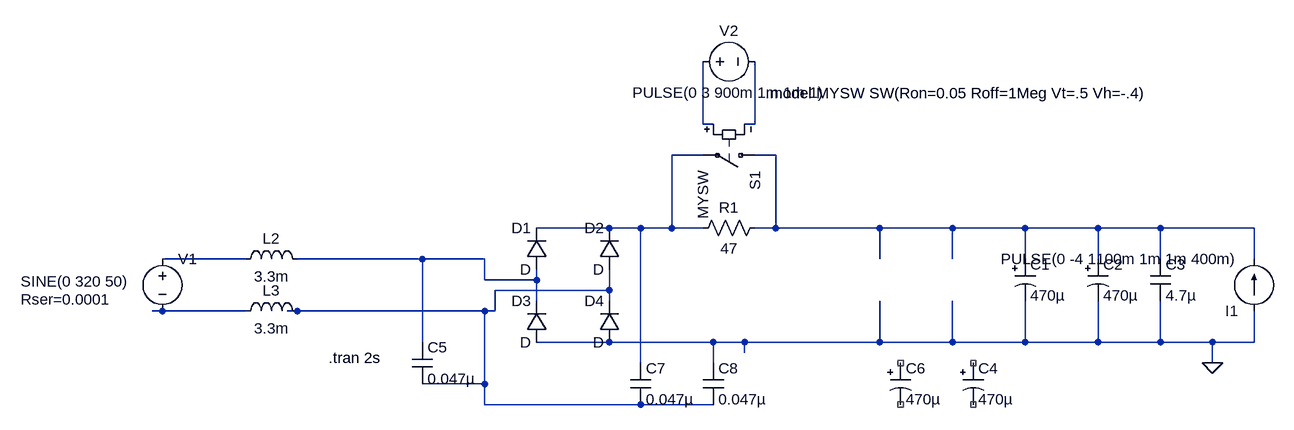
[diagram p0: schematic DClink.asc]
DClink.asc, the LTspice schematic file:
Version 4
SHEET 1 1056 680
WIRE 160 -208 160 -304
WIRE 176 -208 160 -208
WIRE 240 -208 240 -304
WIRE 240 -208 224 -208
WIRE 160 -160 112 -160
WIRE 272 -160 240 -160
WIRE 16 -48 -96 -48
WIRE 64 -48 16 -48
WIRE 112 -48 112 -160
WIRE 112 -48 64 -48
WIRE 160 -48 112 -48
WIRE 272 -48 272 -160
WIRE 272 -48 240 -48
WIRE 432 -48 272 -48
WIRE 544 -48 432 -48
WIRE 656 -48 544 -48
WIRE 768 -48 656 -48
WIRE 864 -48 768 -48
WIRE 1008 -48 864 -48
WIRE -544 0 -672 0
WIRE -272 0 -464 0
WIRE -176 0 -272 0
WIRE 432 0 432 -48
WIRE 544 0 544 -48
WIRE 656 0 656 -48
WIRE 768 0 768 -48
WIRE 864 0 864 -48
WIRE 1008 0 1008 -48
WIRE -176 32 -176 0
WIRE -96 32 -96 16
WIRE -96 32 -176 32
WIRE 16 48 16 16
WIRE 16 48 -160 48
WIRE -96 64 -96 32
WIRE 16 64 16 48
WIRE -672 80 -688 80
WIRE -544 80 -672 80
WIRE -464 80 -480 80
WIRE -176 80 -464 80
WIRE -160 80 -160 48
WIRE -160 80 -176 80
WIRE -272 128 -272 0
WIRE 16 128 -96 128
WIRE 176 128 16 128
WIRE 224 128 176 128
WIRE 432 128 432 64
WIRE 432 128 224 128
WIRE 544 128 544 64
WIRE 544 128 432 128
WIRE 656 128 656 64
WIRE 656 128 544 128
WIRE 768 128 768 64
WIRE 768 128 656 128
WIRE 864 128 864 64
WIRE 864 128 768 128
WIRE 944 128 864 128
WIRE 1008 128 1008 80
WIRE 1008 128 944 128
WIRE 224 144 224 128
WIRE 64 160 64 -48
WIRE 176 160 176 128
WIRE 944 160 944 128
WIRE -176 192 -176 80
WIRE -176 192 -272 192
WIRE -176 224 -176 192
WIRE 64 224 -176 224
WIRE 176 224 64 224
FLAG 944 160 0
SYMBOL diode -80 16 R180
WINDOW 0 24 64 Left 2
WINDOW 3 24 0 Left 2
SYMATTR InstName D1
SYMBOL diode 32 16 R180
WINDOW 0 24 64 Left 2
WINDOW 3 24 0 Left 2
SYMATTR InstName D2
SYMBOL diode -80 128 R180
WINDOW 0 24 64 Left 2
WINDOW 3 24 0 Left 2
SYMATTR InstName D3
SYMBOL diode 32 128 R180
WINDOW 0 24 64 Left 2
WINDOW 3 24 0 Left 2
SYMATTR InstName D4
SYMBOL polcap 640 0 R0
WINDOW 3 24 56 Left 2
SYMATTR Value 470µ
SYMATTR InstName C1
SYMATTR Description Capacitor
SYMATTR Type cap
SYMATTR SpiceLine V=450 Irms=2.89 Rser=0.082 Lser=10.1n mfg="Würth Elektronik" pn="861011487026 WCAP-AIG8 40x42" type="Al electrolytic"
SYMBOL polcap 752 0 R0
WINDOW 3 24 56 Left 2
SYMATTR Value 470µ
SYMATTR InstName C2
SYMATTR Description Capacitor
SYMATTR Type cap
SYMATTR SpiceLine V=450 Irms=2.89 Rser=0.082 Lser=10.1n mfg="Würth Elektronik" pn="861011487026 WCAP-AIG8 40x42" type="Al electrolytic"
SYMBOL cap 848 0 R0
SYMATTR InstName C3
SYMATTR Value 4.7µ
SYMATTR SpiceLine V=1K Irms=0 Rser=0.0227 Lser=99n mfg="Würth Elektronik" pn="890493428013CS WCAP-FTBE 37.5 x 42 x 43 x 31" type="Box"
SYMBOL voltage -672 -16 R0
WINDOW 3 -218 50 Left 2
WINDOW 123 0 0 Left 0
WINDOW 39 -218 78 Left 2
SYMATTR Value SINE(0 320 50)
SYMATTR SpiceLine Rser=0.0001
SYMATTR InstName V1
SYMBOL current 1008 80 R180
WINDOW 123 0 0 Left 0
WINDOW 39 0 0 Left 0
SYMATTR InstName I1
SYMATTR Value PULSE(0 -4 1100m 1m 1m 400m)
SYMBOL res 256 -64 R90
WINDOW 0 0 56 VBottom 2
WINDOW 3 32 56 VTop 2
SYMATTR InstName R1
SYMATTR Value 47
SYMBOL polcap 560 160 R0
WINDOW 3 24 56 Left 2
SYMATTR Value 470µ
SYMATTR InstName C4
SYMATTR Description Capacitor
SYMATTR Type cap
SYMATTR SpiceLine V=450 Irms=2.89 Rser=0.082 Lser=10.1n mfg="Würth Elektronik" pn="861011487026 WCAP-AIG8 40x42" type="Al electrolytic"
SYMBOL cap -288 128 R0
SYMATTR InstName C5
SYMATTR Value 0.047µ
SYMATTR SpiceLine V=630 Irms=0 Rser=0.065 Lser=7.8n mfg="Würth Elektronik" pn="890324023015 WCAP-FTX2 10x13x9.5x4.5" type="X2"
SYMBOL cap 48 160 R0
SYMATTR InstName C7
SYMATTR Value 0.047µ
SYMATTR SpiceLine V=630 Irms=0 Rser=0.065 Lser=7.8n mfg="Würth Elektronik" pn="890324023015 WCAP-FTX2 10x13x9.5x4.5" type="X2"
SYMBOL cap 160 160 R0
SYMATTR InstName C8
SYMATTR Value 0.047µ
SYMATTR SpiceLine V=630 Irms=0 Rser=0.065 Lser=7.8n mfg="Würth Elektronik" pn="890324023015 WCAP-FTX2 10x13x9.5x4.5" type="X2"
SYMBOL sw 256 -160 R90
SYMATTR InstName S1
SYMATTR Value MYSW
SYMBOL voltage 144 -304 R270
WINDOW 0 32 56 VTop 2
WINDOW 3 -32 56 VBottom 2
WINDOW 123 0 0 Left 0
WINDOW 39 0 0 Left 0
SYMATTR InstName V2
SYMATTR Value PULSE(0 3 900m 1m 1m 1)
SYMBOL ind -560 16 R270
WINDOW 0 32 56 VTop 2
WINDOW 3 5 56 VBottom 2
SYMATTR InstName L2
SYMATTR Value 3.3m
SYMATTR SpiceLine Ipk=16 Rser=22m
SYMBOL ind -560 96 R270
WINDOW 0 32 56 VTop 2
WINDOW 3 5 56 VBottom 2
SYMATTR InstName L3
SYMATTR Value 3.3m
SYMATTR SpiceLine Ipk=8 Rser=22m
SYMBOL polcap 448 160 R0
WINDOW 3 24 56 Left 2
SYMATTR Value 470µ
SYMATTR InstName C6
SYMATTR Description Capacitor
SYMATTR Type cap
SYMATTR SpiceLine V=450 Irms=2.89 Rser=0.082 Lser=10.1n mfg="Würth Elektronik" pn="861011487026 WCAP-AIG8 40x42" type="Al electrolytic"
TEXT -416 152 Left 2 !.tran 2s
TEXT 256 -256 Left 2 !.model MYSW SW(Ron=0.05 Roff=1Meg Vt=.5 Vh=-.4)

The netlist it stands for:
* DClink.asc
D1 N006 N003 D
D2 N007 N003 D
D3 0 N006 D
D4 0 N007 D
C1 N004 0 470µ V=450 Irms=2.89 Rser=0.082 Lser=10.1n mfg="Würth Elektronik" pn="861011487026 WCAP-AIG8 40x42" type="Al electrolytic"
C2 N004 0 470µ V=450 Irms=2.89 Rser=0.082 Lser=10.1n mfg="Würth Elektronik" pn="861011487026 WCAP-AIG8 40x42" type="Al electrolytic"
C3 N004 0 4.7µ V=1K Irms=0 Rser=0.0227 Lser=99n mfg="Würth Elektronik" pn="890493428013CS WCAP-FTBE 37.5 x 42 x 43 x 31" type="Box"
V1 N005 N008 SINE(0 320 50) Rser=0.0001
I1 0 N004 PULSE(0 -4 1100m 1m 1m 400m)
R1 N004 N003 47
C4 NC_01 NC_02 470µ V=450 Irms=2.89 Rser=0.082 Lser=10.1n mfg="Würth Elektronik" pn="861011487026 WCAP-AIG8 40x42" type="Al electrolytic"
C5 N006 N007 0.047µ V=630 Irms=0 Rser=0.065 Lser=7.8n mfg="Würth Elektronik" pn="890324023015 WCAP-FTX2 10x13x9.5x4.5" type="X2"
C7 N003 N007 0.047µ V=630 Irms=0 Rser=0.065 Lser=7.8n mfg="Würth Elektronik" pn="890324023015 WCAP-FTX2 10x13x9.5x4.5" type="X2"
C8 0 N007 0.047µ V=630 Irms=0 Rser=0.065 Lser=7.8n mfg="Würth Elektronik" pn="890324023015 WCAP-FTX2 10x13x9.5x4.5" type="X2"
S1 N004 N003 N001 N002 MYSW
V2 N001 N002 PULSE(0 3 900m 1m 1m 1)
L2 N005 N006 3.3m Ipk=16 Rser=22m
L3 N008 N007 3.3m Ipk=8 Rser=22m
C6 NC_03 NC_04 470µ V=450 Irms=2.89 Rser=0.082 Lser=10.1n mfg="Würth Elektronik" pn="861011487026 WCAP-AIG8 40x42" type="Al electrolytic"
.model D D
.lib standard.dio
.tran 2s
.model MYSW SW(Ron=0.05 Roff=1Meg Vt=.5 Vh=-.4)
.backanno
.end